# EAGLE schematic rel-2b-alu (EAGLE 9.1.3)
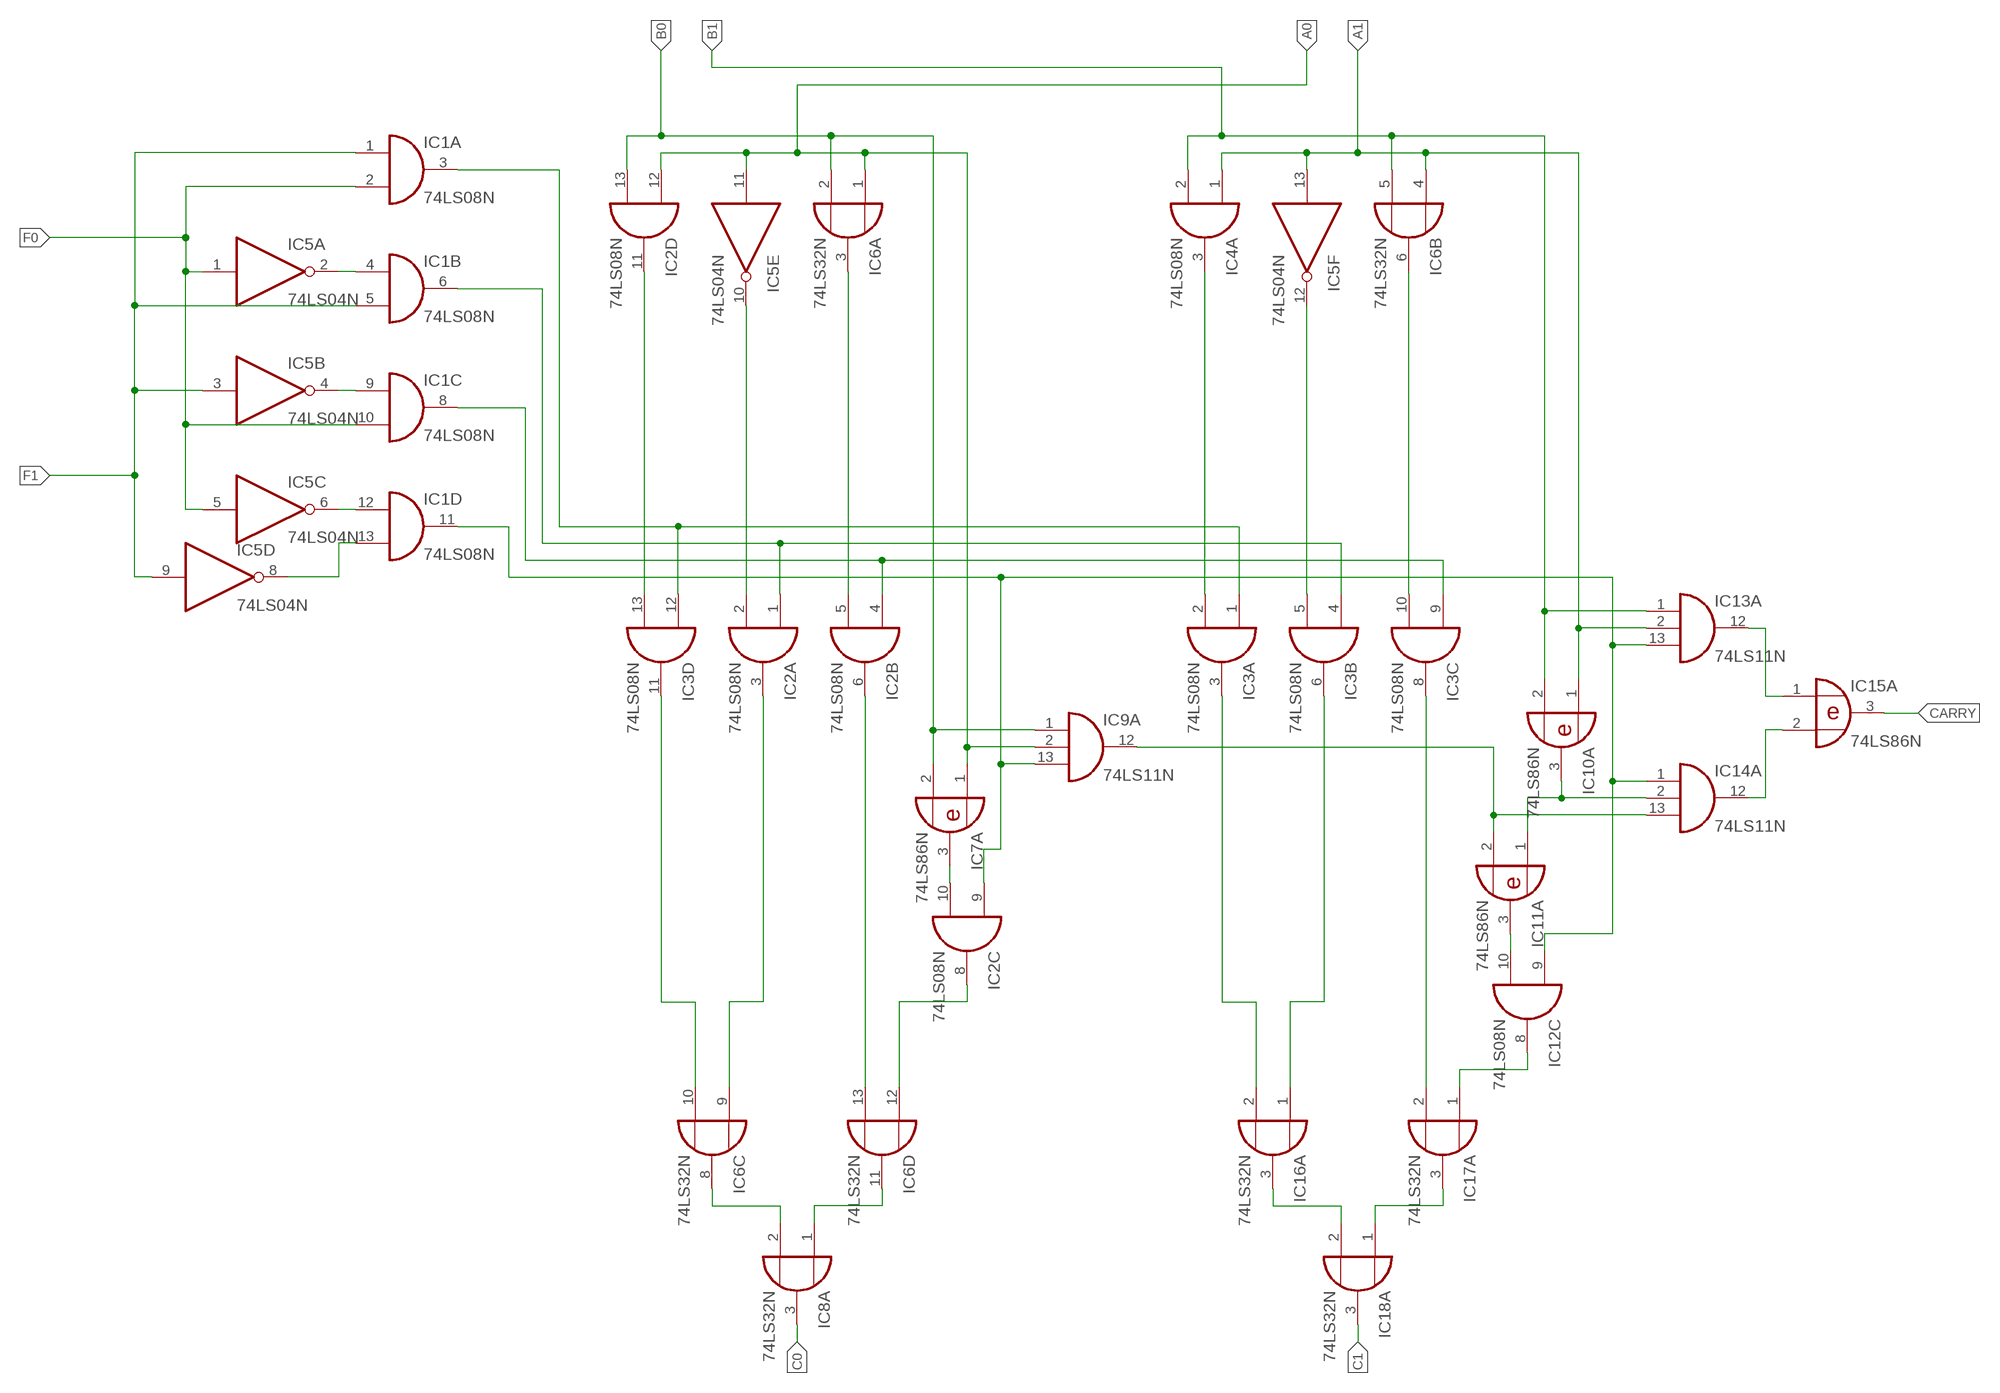
[diagram p0: schematic, sheet 1]

## Parts
IC1  74LS08N  [DIL14]
IC2  74LS08N  [DIL14]
IC3  74LS08N  [DIL14]
IC4  74LS08N  [DIL14]
IC5  74LS04N  [DIL14]
IC6  74LS32N  [DIL14]
IC7  74LS86N  [DIL14]
IC8  74LS32N  [DIL14]
IC9  74LS11N  [DIL14]
IC10  74LS86N  [DIL14]
IC11  74LS86N  [DIL14]
IC12  74LS08N  [DIL14]
IC13  74LS11N  [DIL14]
IC14  74LS11N  [DIL14]
IC15  74LS86N  [DIL14]
IC16  74LS32N  [DIL14]
IC17  74LS32N  [DIL14]
IC18  74LS32N  [DIL14]

## Nets
A0: IC2.12(D:I0) IC5.11(E:I) IC6.1(A:I0) IC7.1(A:I0) IC9.2(A:I1)
A1: IC4.1(A:I0) IC5.13(F:I) IC6.4(B:I0) IC10.1(A:I0) IC13.2(A:I1)
B0: IC2.13(D:I1) IC6.2(A:I1) IC7.2(A:I1) IC9.1(A:I0)
B1: IC4.2(A:I1) IC6.5(B:I1) IC10.2(A:I1) IC13.1(A:I0)
C0: IC8.3(A:O)
C1: IC18.3(A:O)
CARRY: IC15.3(A:O)
F0: IC1.2(A:I1) IC1.10(C:I1) IC5.1(A:I) IC5.5(C:I)
F1: IC1.1(A:I0) IC1.5(B:I1) IC5.3(B:I) IC5.9(D:I)
N$1: IC1.4(B:I0) IC5.2(A:O)
N$2: IC1.9(C:I0) IC5.4(B:O)
N$3: IC1.12(D:I0) IC5.6(C:O)
N$4: IC1.3(A:O) IC3.1(A:I0) IC3.12(D:I0)
N$5: IC1.6(B:O) IC2.1(A:I0) IC3.4(B:I0)
N$6: IC1.13(D:I1) IC5.8(D:O)
N$7: IC1.8(C:O) IC2.4(B:I0) IC3.9(C:I0)
N$8: IC1.11(D:O) IC2.9(C:I0) IC9.13(A:I2) IC12.9(C:I0) IC13.13(A:I2) IC14.1(A:I0)
N$9: IC2.11(D:O) IC3.13(D:I1)
N$10: IC2.2(A:I1) IC5.10(E:O)
N$11: IC2.5(B:I1) IC6.3(A:O)
N$12: IC3.2(A:I1) IC4.3(A:O)
N$13: IC3.5(B:I1) IC5.12(F:O)
N$14: IC3.10(C:I1) IC6.6(B:O)
N$15: IC2.10(C:I1) IC7.3(A:O)
N$16: IC3.11(D:O) IC6.10(C:I1)
N$17: IC2.3(A:O) IC6.9(C:I0)
N$18: IC2.6(B:O) IC6.13(D:I1)
N$19: IC2.8(C:O) IC6.12(D:I0)
N$20: IC6.8(C:O) IC8.2(A:I1)
N$21: IC6.11(D:O) IC8.1(A:I0)
N$22: IC10.3(A:O) IC11.1(A:I0) IC14.2(A:I1)
N$23: IC9.12(A:O) IC11.2(A:I1) IC14.13(A:I2)
N$24: IC3.3(A:O) IC16.2(A:I1)
N$25: IC3.6(B:O) IC16.1(A:I0)
N$26: IC3.8(C:O) IC17.2(A:I1)
N$27: IC11.3(A:O) IC12.10(C:I1)
N$28: IC13.12(A:O) IC15.1(A:I0)
N$29: IC14.12(A:O) IC15.2(A:I1)
N$30: IC12.8(C:O) IC17.1(A:I0)
N$31: IC16.3(A:O) IC18.2(A:I1)
N$32: IC17.3(A:O) IC18.1(A:I0)
Unconnected: IC4.4(B:I0) IC4.5(B:I1) IC4.6(B:O) IC4.8(C:O) IC4.9(C:I0) IC4.10(C:I1) IC4.11(D:O) IC4.12(D:I0) IC4.13(D:I1) IC7.4(B:I0) IC7.5(B:I1) IC7.6(B:O) IC7.8(C:O) IC7.9(C:I0) IC7.10(C:I1) IC7.11(D:O) IC7.12(D:I0) IC7.13(D:I1) IC8.4(B:I0) IC8.5(B:I1) IC8.6(B:O) IC8.8(C:O) IC8.9(C:I0) IC8.10(C:I1) IC8.11(D:O) IC8.12(D:I0) IC8.13(D:I1) IC9.3(B:I0) IC9.4(B:I1) IC9.5(B:I2) IC9.6(B:O) IC9.8(C:O) IC9.9(C:I0) IC9.10(C:I1) IC9.11(C:I2) IC10.4(B:I0) IC10.5(B:I1) IC10.6(B:O) IC10.8(C:O) IC10.9(C:I0) IC10.10(C:I1) IC10.11(D:O) IC10.12(D:I0) IC10.13(D:I1) IC11.4(B:I0) IC11.5(B:I1) IC11.6(B:O) IC11.8(C:O) IC11.9(C:I0) IC11.10(C:I1) IC11.11(D:O) IC11.12(D:I0) IC11.13(D:I1) IC12.1(A:I0) IC12.2(A:I1) IC12.3(A:O) IC12.4(B:I0) IC12.5(B:I1) IC12.6(B:O) IC12.11(D:O) IC12.12(D:I0) IC12.13(D:I1) IC13.3(B:I0) IC13.4(B:I1) IC13.5(B:I2) IC13.6(B:O) IC13.8(C:O) IC13.9(C:I0) IC13.10(C:I1) IC13.11(C:I2) IC14.3(B:I0) IC14.4(B:I1) IC14.5(B:I2) IC14.6(B:O) IC14.8(C:O) IC14.9(C:I0) IC14.10(C:I1) IC14.11(C:I2) IC15.4(B:I0) IC15.5(B:I1) IC15.6(B:O) IC15.8(C:O) IC15.9(C:I0) IC15.10(C:I1) IC15.11(D:O) IC15.12(D:I0) IC15.13(D:I1) IC16.4(B:I0) IC16.5(B:I1) IC16.6(B:O) IC16.8(C:O) IC16.9(C:I0) IC16.10(C:I1) IC16.11(D:O) IC16.12(D:I0) IC16.13(D:I1) IC17.4(B:I0) IC17.5(B:I1) IC17.6(B:O) IC17.8(C:O) IC17.9(C:I0) IC17.10(C:I1) IC17.11(D:O) IC17.12(D:I0) IC17.13(D:I1) IC18.4(B:I0) IC18.5(B:I1) IC18.6(B:O) IC18.8(C:O) IC18.9(C:I0) IC18.10(C:I1) IC18.11(D:O) IC18.12(D:I0) IC18.13(D:I1)

## Power pins joined to a net without a drawn wire
GND: IC1.7(P:GND) IC2.7(P:GND) IC3.7(P:GND) IC4.7(P:GND) IC5.7(P:GND) IC6.7(P:GND) IC7.7(P:GND) IC8.7(P:GND) IC9.7(P:GND) IC10.7(P:GND) IC11.7(P:GND) IC12.7(P:GND) IC13.7(P:GND) IC14.7(P:GND) IC15.7(P:GND) IC16.7(P:GND) IC17.7(P:GND) IC18.7(P:GND)
VCC: IC1.14(P:VCC) IC2.14(P:VCC) IC3.14(P:VCC) IC4.14(P:VCC) IC5.14(P:VCC) IC6.14(P:VCC) IC7.14(P:VCC) IC8.14(P:VCC) IC9.14(P:VCC) IC10.14(P:VCC) IC11.14(P:VCC) IC12.14(P:VCC) IC13.14(P:VCC) IC14.14(P:VCC) IC15.14(P:VCC) IC16.14(P:VCC) IC17.14(P:VCC) IC18.14(P:VCC)

## Library data of the parts
IC1-IC4 IC12 = 74xx-eu:74*08: Quad 2-input AND gate
IC5 = 74xx-eu:74*04: Hex INVERTER
IC6 IC8 IC16-IC18 = 74xx-eu:74*32: Quad 2-input OR gate
IC7 IC10 IC11 IC15 = 74xx-eu:74*86: Quad 2-input EXCLUSIVE-OR (XOR) gate
IC9 IC13 IC14 = 74xx-eu:74*11: Triple 3-input AND gate